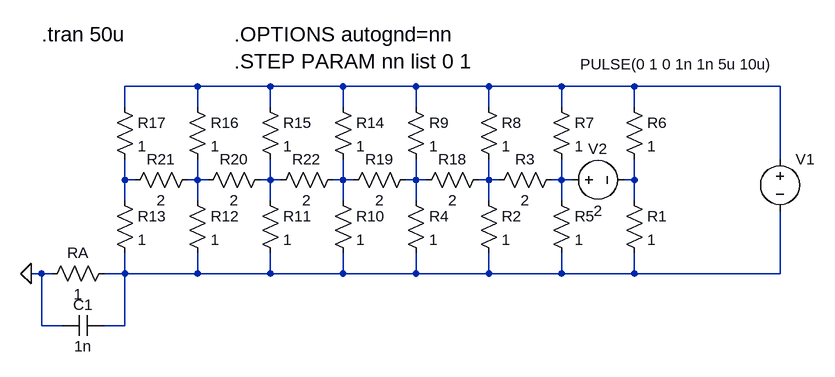
[diagram p0: schematic Fig_3-27_AUTOGND.asc]
Fig_3-27_AUTOGND.asc, the LTspice schematic file:
Version 4
SHEET 1 1588 804
WIRE -336 -416 -448 -416
WIRE -224 -416 -336 -416
WIRE -112 -416 -224 -416
WIRE 0 -416 -112 -416
WIRE 112 -416 0 -416
WIRE 224 -416 112 -416
WIRE 336 -416 224 -416
WIRE 560 -416 336 -416
WIRE -448 -384 -448 -416
WIRE -336 -384 -336 -416
WIRE -224 -384 -224 -416
WIRE -112 -384 -112 -416
WIRE 0 -384 0 -416
WIRE 112 -384 112 -416
WIRE 224 -384 224 -416
WIRE 336 -384 336 -416
WIRE 560 -304 560 -416
WIRE -448 -272 -448 -304
WIRE -432 -272 -448 -272
WIRE -336 -272 -336 -304
WIRE -336 -272 -352 -272
WIRE -320 -272 -336 -272
WIRE -224 -272 -224 -304
WIRE -224 -272 -240 -272
WIRE -208 -272 -224 -272
WIRE -112 -272 -112 -304
WIRE -112 -272 -128 -272
WIRE -96 -272 -112 -272
WIRE 0 -272 0 -304
WIRE 0 -272 -16 -272
WIRE 16 -272 0 -272
WIRE 112 -272 112 -304
WIRE 112 -272 96 -272
WIRE 128 -272 112 -272
WIRE 224 -272 224 -304
WIRE 224 -272 208 -272
WIRE 240 -272 224 -272
WIRE 336 -272 336 -304
WIRE 336 -272 320 -272
WIRE -448 -240 -448 -272
WIRE -336 -240 -336 -272
WIRE -224 -240 -224 -272
WIRE -112 -240 -112 -272
WIRE 0 -240 0 -272
WIRE 112 -240 112 -272
WIRE 224 -240 224 -272
WIRE 336 -240 336 -272
WIRE -576 -128 -592 -128
WIRE -560 -128 -576 -128
WIRE -448 -128 -448 -160
WIRE -448 -128 -480 -128
WIRE -336 -128 -336 -160
WIRE -336 -128 -448 -128
WIRE -224 -128 -224 -160
WIRE -224 -128 -336 -128
WIRE -112 -128 -112 -160
WIRE -112 -128 -224 -128
WIRE 0 -128 0 -160
WIRE 0 -128 -112 -128
WIRE 112 -128 112 -160
WIRE 112 -128 0 -128
WIRE 224 -128 224 -160
WIRE 224 -128 112 -128
WIRE 336 -128 336 -160
WIRE 336 -128 224 -128
WIRE 560 -128 560 -224
WIRE 560 -128 336 -128
WIRE -576 -48 -576 -128
WIRE -544 -48 -576 -48
WIRE -448 -48 -448 -128
WIRE -448 -48 -480 -48
FLAG -592 -128 0
SYMBOL voltage 560 -320 R0
WINDOW 123 0 0 Left 2
WINDOW 39 0 0 Left 2
WINDOW 3 -307 -130 Left 2
SYMATTR Value PULSE(0 1 0 1n 1n 5u 10u)
SYMATTR InstName V1
SYMBOL res 320 -256 R0
SYMATTR InstName R1
SYMATTR Value 1
SYMBOL res -464 -144 R90
WINDOW 0 0 56 VBottom 2
WINDOW 3 32 56 VTop 2
SYMATTR InstName RA
SYMATTR Value 1
SYMBOL res 208 -256 R0
SYMATTR InstName R5
SYMATTR Value 1
SYMBOL res 96 -256 R0
SYMATTR InstName R2
SYMATTR Value 1
SYMBOL res -16 -256 R0
SYMATTR InstName R4
SYMATTR Value 1
SYMBOL res 320 -400 R0
SYMATTR InstName R6
SYMATTR Value 1
SYMBOL res 208 -400 R0
SYMATTR InstName R7
SYMATTR Value 1
SYMBOL res 96 -400 R0
SYMATTR InstName R8
SYMATTR Value 1
SYMBOL res -16 -400 R0
SYMATTR InstName R9
SYMATTR Value 1
SYMBOL res -128 -256 R0
SYMATTR InstName R10
SYMATTR Value 1
SYMBOL res -240 -256 R0
SYMATTR InstName R11
SYMATTR Value 1
SYMBOL res -352 -256 R0
SYMATTR InstName R12
SYMATTR Value 1
SYMBOL res -464 -256 R0
SYMATTR InstName R13
SYMATTR Value 1
SYMBOL res -128 -400 R0
SYMATTR InstName R14
SYMATTR Value 1
SYMBOL res -240 -400 R0
SYMATTR InstName R15
SYMATTR Value 1
SYMBOL res -352 -400 R0
SYMATTR InstName R16
SYMATTR Value 1
SYMBOL res -464 -400 R0
SYMATTR InstName R17
SYMATTR Value 1
SYMBOL voltage 224 -272 R270
WINDOW 0 32 56 VTop 2
WINDOW 3 -32 56 VBottom 2
WINDOW 123 0 0 Left 2
WINDOW 39 0 0 Left 2
SYMATTR InstName V2
SYMATTR Value 2
SYMBOL res 224 -288 R90
WINDOW 0 0 56 VBottom 2
WINDOW 3 32 56 VTop 2
SYMATTR InstName R3
SYMATTR Value 2
SYMBOL res 112 -288 R90
WINDOW 0 0 56 VBottom 2
WINDOW 3 32 56 VTop 2
SYMATTR InstName R18
SYMATTR Value 2
SYMBOL res 0 -288 R90
WINDOW 0 0 56 VBottom 2
WINDOW 3 32 56 VTop 2
SYMATTR InstName R19
SYMATTR Value 2
SYMBOL res -224 -288 R90
WINDOW 0 0 56 VBottom 2
WINDOW 3 32 56 VTop 2
SYMATTR InstName R20
SYMATTR Value 2
SYMBOL res -336 -288 R90
WINDOW 0 0 56 VBottom 2
WINDOW 3 32 56 VTop 2
SYMATTR InstName R21
SYMATTR Value 2
SYMBOL res -112 -288 R90
WINDOW 0 0 56 VBottom 2
WINDOW 3 32 56 VTop 2
SYMATTR InstName R22
SYMATTR Value 2
SYMBOL cap -480 -64 R90
WINDOW 0 0 32 VBottom 2
WINDOW 3 32 32 VTop 2
SYMATTR InstName C1
SYMATTR Value 1n
TEXT -576 -496 Left 3 !.tran 50u
TEXT -280 -496 Left 3 !.OPTIONS autognd=nn\n.STEP PARAM nn list 0 1

The netlist it stands for:
* Fig_3-27_AUTOGND.asc
V1 N001 N010 PULSE(0 1 0 1n 1n 5u 10u)
R1 N009 N010 1
RA N010 0 1
R5 N008 N010 1
R2 N007 N010 1
R4 N006 N010 1
R6 N001 N009 1
R7 N001 N008 1
R8 N001 N007 1
R9 N001 N006 1
R10 N005 N010 1
R11 N004 N010 1
R12 N003 N010 1
R13 N002 N010 1
R14 N001 N005 1
R15 N001 N004 1
R16 N001 N003 1
R17 N001 N002 1
V2 N008 N009 2
R3 N008 N007 2
R18 N007 N006 2
R19 N006 N005 2
R20 N004 N003 2
R21 N003 N002 2
R22 N005 N004 2
C1 N010 0 1n
.tran 50u
.OPTIONS autognd=nn
.STEP PARAM nn list 0 1
.backanno
.end